# Altium schematic sheet SNES TST Sheet4.SchDoc: SNES TST
size A4; DrawnBy: Opatus; DocumentNumber: 4; Revision: 0; SheetNumber: 4; SheetTotal: 5
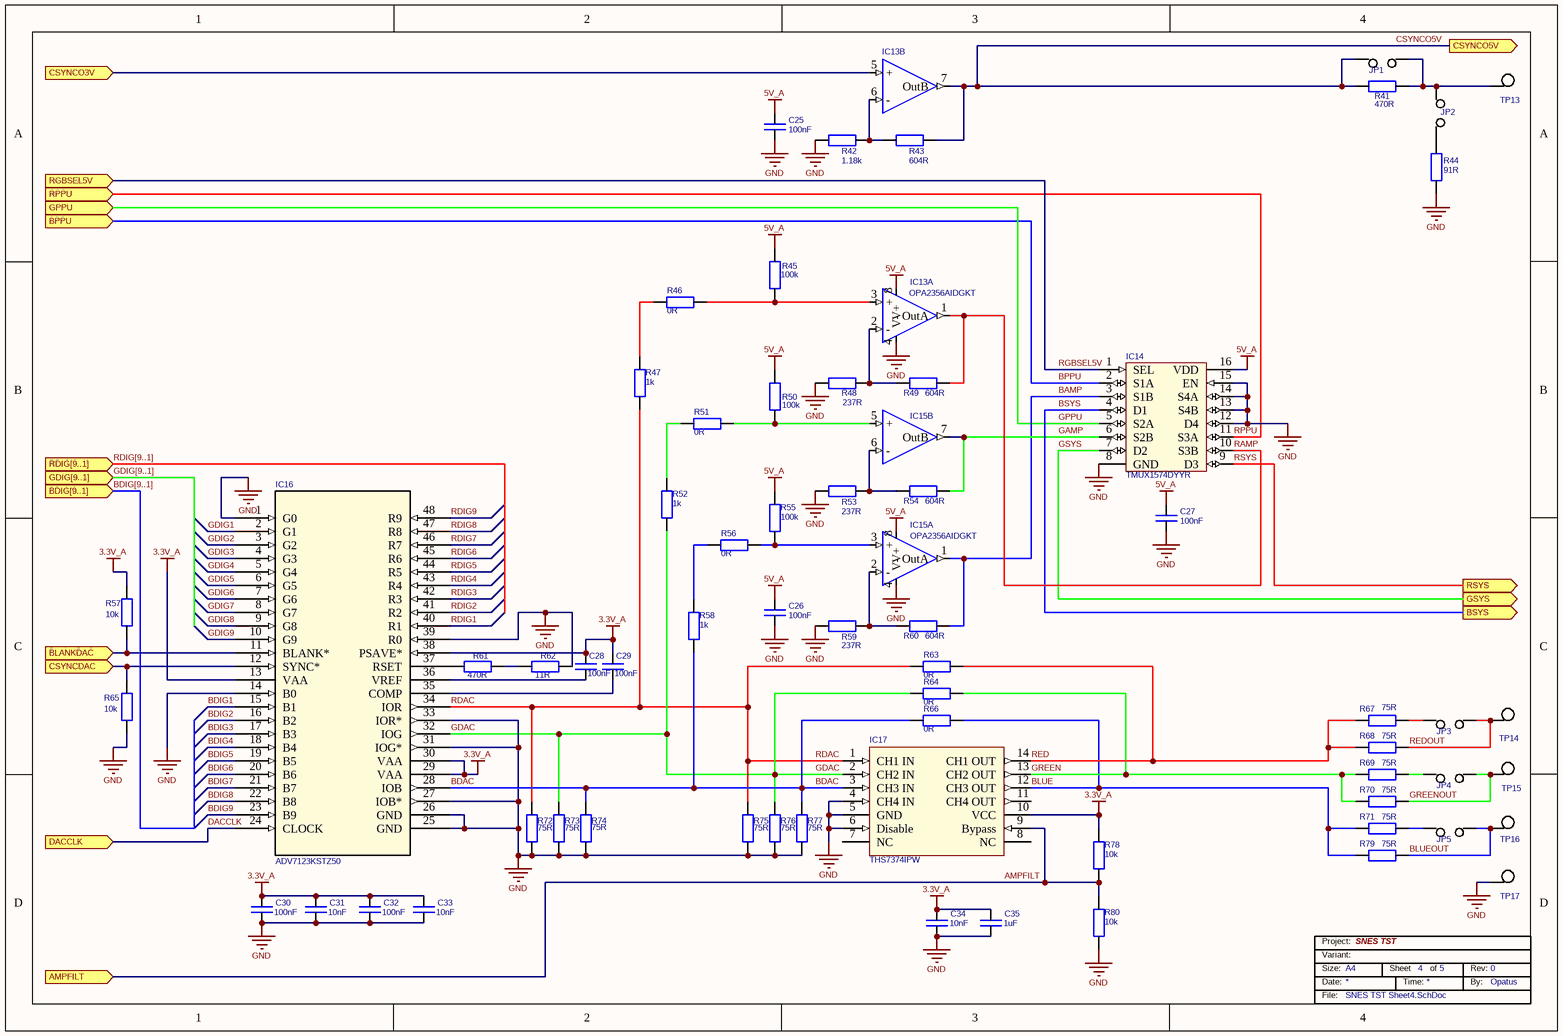
[diagram p0: SNES TST Sheet4.SchDoc]

## Parts
C25  value 100nF  [Cap_0402_Chip]  (hidden comment: Ceramic Capacitor 100nF 10V ±20% X7R 0402)
C26  value 100nF  [Cap_0402_Chip]  (hidden comment: Ceramic Capacitor 100nF 10V ±20% X7R 0402)
C27  value 100nF  [Cap_0402_Chip]  (hidden comment: Ceramic Capacitor 100nF 10V ±20% X7R 0402)
C28  value 100nF  [Cap_0402_Chip]  (hidden comment: Ceramic Capacitor 100nF 10V ±20% X7R 0402)
C29  value 100nF  [Cap_0402_Chip]  (hidden comment: Ceramic Capacitor 100nF 10V ±20% X7R 0402)
C30  value 100nF  [Cap_0402_Chip]  (hidden comment: Ceramic Capacitor 100nF 10V ±20% X7R 0402)
C31  value 10nF  [Cap_0402_Chip]  (hidden comment: Ceramic Capacitor 10nF 10V ±20% X7R 0402)
C32  value 100nF  [Cap_0402_Chip]  (hidden comment: Ceramic Capacitor 100nF 10V ±20% X7R 0402)
C33  value 10nF  [Cap_0402_Chip]  (hidden comment: Ceramic Capacitor 10nF 10V ±20% X7R 0402)
C34  value 10nF  [Cap_0402_Chip]  (hidden comment: Ceramic Capacitor 10nF 10V ±20% X7R 0402)
C35  value 1uF  [Cap_0603_Chip]  (hidden comment: Ceramic Capacitor 1uF 10V ±20% X7R 0603)
IC13  Manufacturer_Part_Number: OPA2356AIDGKT  [MSOP8]  (hidden comment: OPA2356)  (parts A,B of 2)
IC14  Manufacturer_Part_Number: TMUX1574DYYR  [SOT-23THIN16]  (hidden comment: TMUX1574)
IC15  Manufacturer_Part_Number: OPA2356AIDGKT  [MSOP8]  (hidden comment: OPA2356)  (parts A,B of 2)
IC16  Manufacturer_Part_Number: ADV7123KSTZ50  [ST_48_ADI]  (hidden comment: ADV7123)
IC17  Manufacturer_Part_Number: THS7374IPW  [TSSOP14]  (hidden comment: THS7374)
JP1  Jumper  [Jumper]  (value not drawn)  (no BOM)
JP2  Jumper  [Jumper]  (value not drawn)  (no BOM)
JP3  Jumper  [Jumper]  (value not drawn)  (no BOM)
JP4  Jumper  [Jumper]  (value not drawn)  (no BOM)
JP5  Jumper  [Jumper]  (value not drawn)  (no BOM)
R41  value 470R  [Res_0603_Chip]  (hidden comment: Resistor 470R 0603 ±1%)
R42  value 1.18k  [Res_0402_Chip]  (hidden comment: Resistor 1.18k 0402 ±1%)
R43  value 604R  [Res_0402_Chip]  (hidden comment: Resistor 604R 0402 ±1%)
R44  value 91R  [Res_0603_Chip]  (hidden comment: Resistor 91R 0603 ±1%)
R45  value 100k  [Res_0402_Chip]  (hidden comment: Resistor 100k 0402 ±1%)
R46  value 0R  [Res_0402_Chip]  (hidden comment: Resistor 0R 0402)
R47  value 1k  [Res_0402_Chip]  (hidden comment: Resistor 1k 0402 ±1%)
R48  value 237R  [Res_0402_Chip]  (hidden comment: Resistor 237R 0402 ±1%)
R49  value 604R  [Res_0402_Chip]  (hidden comment: Resistor 604R 0402 ±1%)
R50  value 100k  [Res_0402_Chip]  (hidden comment: Resistor 100k 0402 ±1%)
R51  value 0R  [Res_0402_Chip]  (hidden comment: Resistor 0R 0402)
R52  value 1k  [Res_0402_Chip]  (hidden comment: Resistor 1k 0402 ±1%)
R53  value 237R  [Res_0402_Chip]  (hidden comment: Resistor 237R 0402 ±1%)
R54  value 604R  [Res_0402_Chip]  (hidden comment: Resistor 604R 0402 ±1%)
R55  value 100k  [Res_0402_Chip]  (hidden comment: Resistor 100k 0402 ±1%)
R56  value 0R  [Res_0402_Chip]  (hidden comment: Resistor 0R 0402)
R57  value 10k  [Res_0402_Chip]  (hidden comment: Resistor 10k 0402 ±1%)
R58  value 1k  [Res_0402_Chip]  (hidden comment: Resistor 1k 0402 ±1%)
R59  value 237R  [Res_0402_Chip]  (hidden comment: Resistor 237R 0402 ±1%)
R60  value 604R  [Res_0402_Chip]  (hidden comment: Resistor 604R 0402 ±1%)
R61  value 470R  [Res_0402_Chip]  (hidden comment: Resistor 470R 0402 ±1%)
R62  value 11R  [Res_0402_Chip]  (hidden comment: Resistor 11R 0402 ±1%)
R63  value 0R  [Res_0402_Chip]  (hidden comment: Resistor 0R 0402)
R64  value 0R  [Res_0402_Chip]  (hidden comment: Resistor 0R 0402)
R65  value 10k  [Res_0402_Chip]  (hidden comment: Resistor 10k 0402 ±1%)
R66  value 0R  [Res_0402_Chip]  (hidden comment: Resistor 0R 0402)
R67  value 75R  [Res_0603_Chip]  (hidden comment: Resistor 75R 0603 ±1%)
R68  value 75R  [Res_0603_Chip]  (hidden comment: Resistor 75R 0603 ±1%)
R69  value 75R  [Res_0603_Chip]  (hidden comment: Resistor 75R 0603 ±1%)
R70  value 75R  [Res_0603_Chip]  (hidden comment: Resistor 75R 0603 ±1%)
R71  value 75R  [Res_0603_Chip]  (hidden comment: Resistor 75R 0603 ±1%)
R72  value 75R  [Res_0402_Chip]  (hidden comment: Resistor 75R 0402 ±1%)
R73  value 75R  [Res_0402_Chip]  (hidden comment: Resistor 75R 0402 ±1%)
R74  value 75R  [Res_0402_Chip]  (hidden comment: Resistor 75R 0402 ±1%)
R75  value 75R  [Res_0402_Chip]  (hidden comment: Resistor 75R 0402 ±1%)
R76  value 75R  [Res_0402_Chip]  (hidden comment: Resistor 75R 0402 ±1%)
R77  value 75R  [Res_0402_Chip]  (hidden comment: Resistor 75R 0402 ±1%)
R78  value 10k  [Res_0402_Chip]  (hidden comment: Resistor 10k 0402 ±1%)
R79  value 75R  [Res_0603_Chip]  (hidden comment: Resistor 75R 0603 ±1%)
R80  value 10k  [Res_0402_Chip]  (hidden comment: Resistor 10k 0402 ±1%)
TP13  Pin Connector  [Pin Connector Small]  (value not drawn)  (no BOM)
TP14  Pin Connector  [Pin Connector Small]  (value not drawn)  (no BOM)
TP15  Pin Connector  [Pin Connector Small]  (value not drawn)  (no BOM)
TP16  Pin Connector  [Pin Connector Small]  (value not drawn)  (no BOM)
TP17  Pin Connector  [Pin Connector Small]  (value not drawn)  (no BOM)

## Ports
AMPFILT (in), BDIG[9..1] (in), BLANKDAC (in), BPPU (in), BSYS (out), CSYNCDAC (in), CSYNCO3V (in), CSYNCO5V (out), DACCLK (in), GDIG[9..1] (in), GPPU (in), GSYS (out), RDIG[9..1] (in), RGBSEL5V (in), RPPU (in), RSYS (out)

## Nets
3.3V_A: C28.1 C29.1 C30.2 C31.2 C32.2 C33.2 C34.2 C35.2 IC16.13(VAA) IC16.29(VAA) IC16.30(VAA) IC16.38(PSAVE*) IC17.10(VCC) R57.2 R78.1
5V_A: C25.1 C26.1 C27.1 IC13.8(V+) IC14.16(VDD) IC15.8(V+) R45.2 R50.2 R55.2
GND: C25.2 C26.2 C27.2 C30.1 C31.1 C32.1 C33.1 C34.1 C35.1 IC13.4(V-) IC14.8(GND) IC14.12(D4) IC14.13(S4B) IC14.14(S4A) IC14.15(EN) IC15.4(V-) IC16.1(G0) IC16.14(B0) IC16.25(GND) IC16.26(GND) IC16.27(IOB*) IC16.31(IOG*) IC16.33(IOR*) IC16.39(R0) IC17.4(CH4_IN) IC17.5(GND) IC17.6(Disable) R42.1 R44.1 R48.1 R53.1 R59.2 R62.2 R65.1 R72.1 R73.1 R74.1 R75.1 R76.1 R77.1 R80.2 TP17.1
AMPFILT: IC17.9(Bypass) R78.2 R80.1 ; port AMPFILT
BAMP: IC14.3(S1B) IC15.1(OutA) R60.2
BDAC: IC16.28(IOB) IC17.3(CH3_IN) R58.2 R66.2 R74.2 R77.2
BDIG1: IC16.15(B1)
BDIG2: IC16.16(B2)
BDIG3: IC16.17(B3)
BDIG4: IC16.18(B4)
BDIG5: IC16.19(B5)
BDIG6: IC16.20(B6)
BDIG7: IC16.21(B7)
BDIG8: IC16.22(B8)
BDIG9: IC16.23(B9)
BLANKDAC: IC16.11(BLANK*) R57.1 ; port BLANKDAC
BLUE: IC17.12(CH3_OUT) R66.1 R71.1 R79.1
BLUEOUT: JP5.1 R79.2 TP16.1
BPPU: IC14.2(S1A) ; port BPPU
BSYS: IC14.4(D1) ; port BSYS
CSYNCDAC: IC16.12(SYNC*) R65.2 ; port CSYNCDAC
CSYNCO3V: IC13.5(+) ; port CSYNCO3V
CSYNCO5V: IC13.7(OutB) JP1.2 R41.1 R43.1 ; port CSYNCO5V
DACCLK: IC16.24(CLOCK) ; port DACCLK
GAMP: IC14.6(S2B) IC15.7(OutB) R54.1
GDAC: IC16.32(IOG) IC17.2(CH2_IN) R52.2 R64.2 R73.2 R76.2
GDIG1: IC16.2(G1)
GDIG2: IC16.3(G2)
GDIG3: IC16.4(G3)
GDIG4: IC16.5(G4)
GDIG5: IC16.6(G5)
GDIG6: IC16.7(G6)
GDIG7: IC16.8(G7)
GDIG8: IC16.9(G8)
GDIG9: IC16.10(G9)
GPPU: IC14.5(S2A) ; port GPPU
GREEN: IC17.13(CH2_OUT) R64.1 R69.1 R70.1
GREENOUT: JP4.1 R70.2 TP15.1
GSYS: IC14.7(D2) ; port GSYS
RAMP: IC13.1(OutA) IC14.10(S3B) R49.2
RDAC: IC16.34(IOR) IC17.1(CH1_IN) R47.2 R63.2 R72.2 R75.2
RDIG1: IC16.40(R1)
RDIG2: IC16.41(R2)
RDIG3: IC16.42(R3)
RDIG4: IC16.43(R4)
RDIG5: IC16.44(R5)
RDIG6: IC16.45(R6)
RDIG7: IC16.46(R7)
RDIG8: IC16.47(R8)
RDIG9: IC16.48(R9)
RED: IC17.14(CH1_OUT) R63.1 R67.1 R68.1
REDOUT: JP3.1 R68.2 TP14.1
RGBSEL5V: IC14.1(SEL) ; port RGBSEL5V
RPPU: IC14.11(S3A) ; port RPPU
RSYS: IC14.9(D3) ; port RSYS
NetC28_2: C28.2 IC16.36(VREF)
NetC29_2: C29.2 IC16.35(COMP)
NetIC13_2: IC13.2(-) R48.2 R49.1
NetIC13_3: IC13.3(+) R45.1 R46.1
NetIC13_6: IC13.6(-) R42.2 R43.2
NetIC15_2: IC15.2(-) R59.1 R60.1
NetIC15_3: IC15.3(+) R55.1 R56.1
NetIC15_5: IC15.5(+) R50.1 R51.1
NetIC15_6: IC15.6(-) R53.2 R54.2
NetIC16_37: IC16.37(RSET) R61.1
NetJP1_1: JP1.1 JP2.1 R41.2 TP13.1
NetJP2_2: JP2.2 R44.2
NetJP3_2: JP3.2 R67.2
NetJP4_2: JP4.2 R69.2
NetJP5_2: JP5.2 R71.2
NetR46_2: R46.2 R47.1
NetR51_2: R51.2 R52.1
NetR56_2: R56.2 R58.1
NetR61_2: R61.2 R62.1

Not connected (* = marked no-connect by the designer): IC17 7(NC) 8(NC) 11(CH4_OUT)

## Buses and harness runs
bus BDIG[9..1] = port BDIG[9..1]
bus GDIG[9..1] = port GDIG[9..1]
bus RDIG[9..1] = port RDIG[9..1]

## Notes on the sheet
- Size:
- Date:
- Variant:
- Project:
- A4
- Sheet
- Time:
- of
- Rev:
- By:
- File:

## Library data of the parts
C25-C34 = Capacitor: ChipSize: 0402; NominalVoltage: 10V; Dielectric: X7R; Tolerance: ±20%; PartType: Ceramic Capacitor
C35 = Capacitor: ChipSize: 0603; NominalVoltage: 10V; Dielectric: X7R; Tolerance: ±20%; PartType: Ceramic Capacitor
IC13 IC15 = OPA2356: Vendor: Analog Devices
IC14 = TMUX1574: SPDT 4 Ch; Vendor: Texas Instruments
IC16 = ADV7123KSTZ140: 10Bit Video DAC; Vendor: Analog Devices Inc; Built_By: EMA_UL_Team; SourceLibrary: Analog_2012-01-01_8; Copyright: Copyright (C) 2018 Accelerated Designs. All rights reserved; RefDes: RefDes; Type: DEV
IC17 = THS7374: Vendor: Texas Instruments
R41 R44 R67-R71 R79 = R: ChipSize: 0603; Tolerance: ±1%; PartType: Resistor
R42 R43 R45-R66 R72-R78 R80 = R: ChipSize: 0402; PartType: Resistor
  R42 R43 R45 R47-R50 R52-R55 R57-R62 R65 R72-R78 R80: Tolerance: ±1%